# Altium project ZZCBoard4.0.PrjPCB
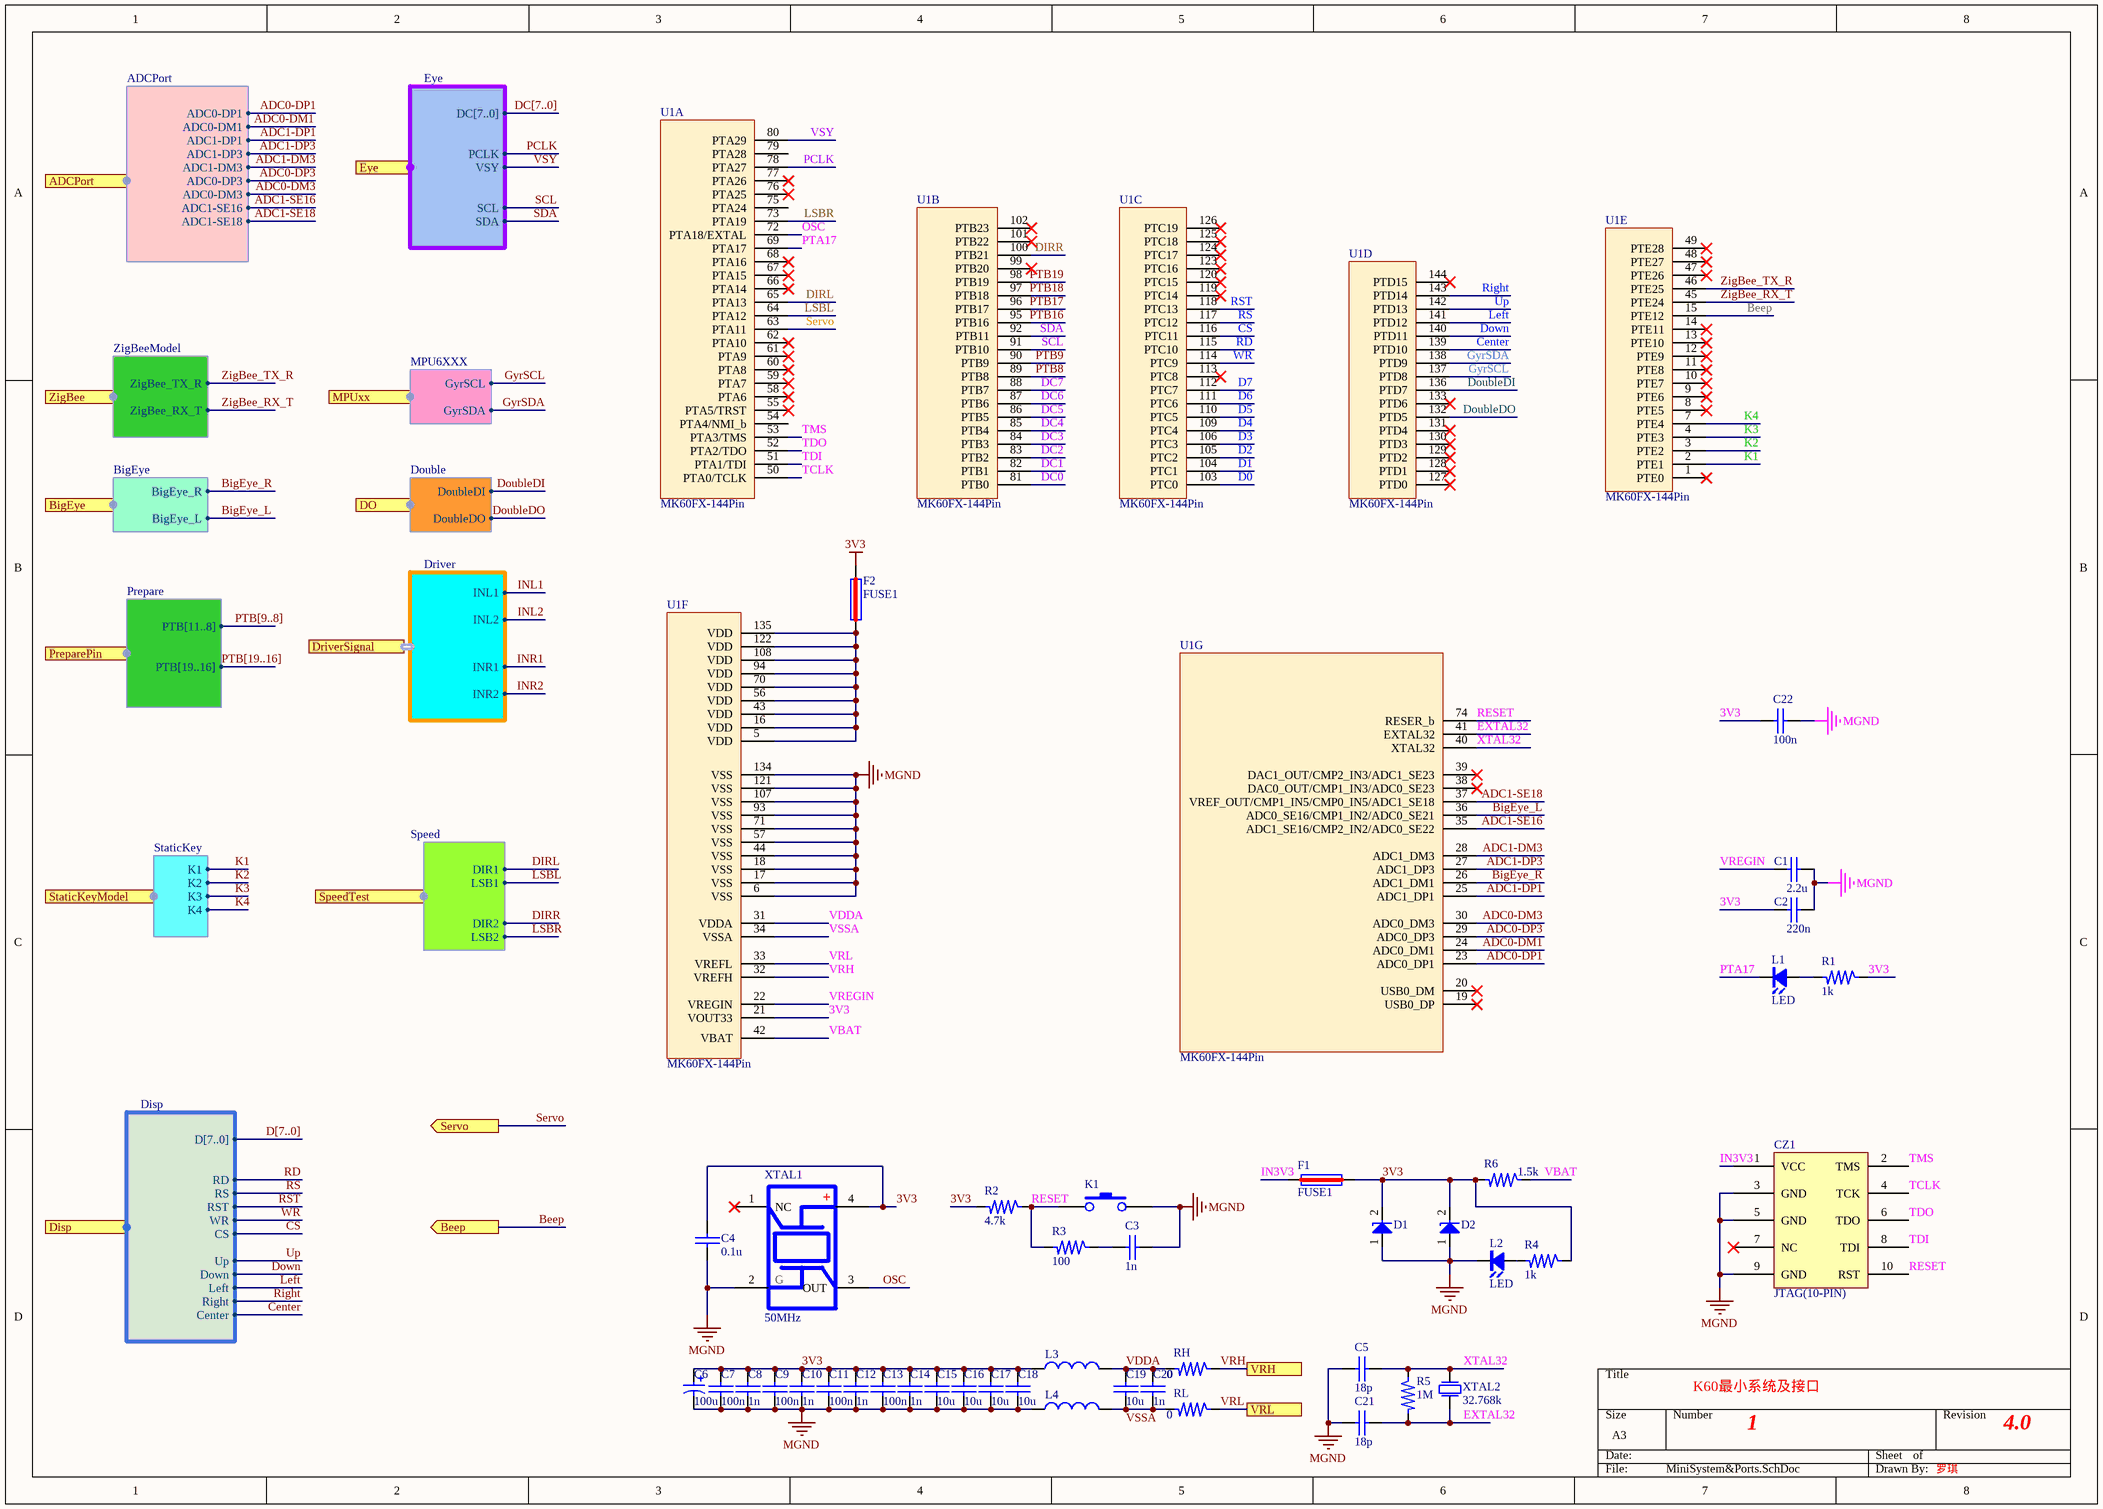
[diagram p0: MiniSystem&Ports.SchDoc]
7 sheets, 141 parts. Net scope: flat (ports and power ports of the same name join across sheets).
Board file: ZZCBoard4.0.PcbDoc
Sheets:
  MiniSystem&Ports.SchDoc
  ServoPower.SchDoc
  7971DoubleDriver.SchDoc
  Disp&Eye.SchDoc
  PowerGroup.SchDoc
  Models.SchDoc
  Measure&Select.SchDoc

## Sheet MiniSystem&Ports.SchDoc: K60最小系统及接口
size A3; DrawnBy: 罗琪; Engineer: 罗琪; Revision: 4.0; SheetNumber: 1

### Parts
C1  2.2u  [C0603]
C2  220n  [C0603]
C3  1n  [C0603]
C4  0.1u  [C0603]
C5  18p  [C0603]
C6  100u  [CAP-E SMD-C]
C7  100n  [C0603]
C8  1n  [C0603]
C9  100n  [C0603]
C10  1n  [C0603]
C11  100n  [C0603]
C12  1n  [C0603]
C13  100n  [C0603]
C14  1n  [C0603]
C15  10u  [C0805]
C16  10u  [C0805]
C17  10u  [C0805]
C18  10u  [C0805]
C19  10u  [C0805]
C20  1n  [C0603]
C21  18p  [C0603]
C22  100n  [C0603]
CZ1  JTAG(10-PIN)  [JTAG 10-pin Header]
D1  EN5819  [D1206]  (value not drawn)
D2  EN5819  [D1206]  (value not drawn)
F1  FUSE1  [FUSE-F1210]
F2  FUSE1  [FUSE-F1210]
K1  SW  [KEY-K2]  (value not drawn)
L1  LED  [LED0805TB]
L2  LED  [LED0805TB]
L3  INDUCTOR  [L0805]  (value not drawn)
L4  INDUCTOR  [L0805]  (value not drawn)
R1  1k  [R0603]
R2  4.7k  [R0603]
R3  100  [R0603]
R4  1k  [R0603]
R5  1M  [R0603]
R6  1.5k  [R0603]
RH  0  [R0603]
RL  0  [R0603]
U1  MK60FX-144Pin  [LQFP144]  (parts A,B,C,D,E,F,G of 7)
XTAL1  50MHz  [XTAL-6035]
XTAL2  32.768k  [XTAL_32.768]

### Ports
ADCPort (harness ADCPort), Beep (out), BigEye (harness BigEye), Disp (harness Disp), DO (harness Double), DriverSignal (harness Driver), Eye (harness Eye), MPUxx (harness MPU6XXX), PreparePin (harness Prepare), Servo (out), SpeedTest (harness Speed), StaticKeyModel (harness StaticKey), VRH, VRL, ZigBee (harness ZigBeeModel)

### Harnesses
MPU6XXX: GyrSCL, GyrSDA
ZigBeeModel: ZigBee_TX_R, ZigBee_RX_T
BigEye: BigEye_R, BigEye_L
Double: DoubleDI, DoubleDO
ADCPort: ADC0-DP1, ADC0-DM1, ADC1-DP1, ADC1-DP3, ADC1-DM3, ADC0-DP3, ADC0-DM3, ADC1-SE16, ADC1-SE18
Prepare: PTB[11..8], PTB[19..16]
Driver: INL1, INL2, INR1, INR2
Disp: D[7..0], RD, RS, RST, WR, Up, Down, Left, Right, Center, CS
Eye: DC[7..0], PCLK, VSY, SCL, SDA
StaticKey: K1, K2, K3, K4
Speed: DIR1, LSB1, LSB2, DIR2

### Nets
3V3: C2.2 C4.1 C6.1 C7.2 C8.2 C9.2 C10.2 C11.2 C12.2 C13.2 C14.2 C15.2 C16.2 C17.2 C18.2 C22.1 D1.2 D2.2 F1.2 F2.2 L3.1 R1.2 R2.1 R4.2 R6.1 U1.21(VOUT33) XTAL1.4(VCC)
MGND: C1.1 C2.1 C3.2 C4.2 C5.1 C6.2 C7.1 C8.1 C9.1 C10.1 C11.1 C12.1 C13.1 C14.1 C15.1 C16.1 C17.1 C18.1 C21.1 C22.2 CZ1.3(GND) CZ1.5(GND) CZ1.9(GND) D1.1 D2.1 K1.2 L2.2(K) L4.1 U1.6(VSS) U1.17(VSS) U1.18(VSS) U1.44(VSS) U1.57(VSS) U1.71(VSS) U1.93(VSS) U1.107(VSS) U1.121(VSS) U1.134(VSS) XTAL1.2(GND)
ADC0-DM1: U1.24(ADC0_DM1) ; port ADCPort.ADC0-DM1
ADC0-DM3: U1.30(ADC0_DM3) ; port ADCPort.ADC0-DM3
ADC0-DP1: U1.23(ADC0_DP1) ; port ADCPort.ADC0-DP1
ADC0-DP3: U1.29(ADC0_DP3) ; port ADCPort.ADC0-DP3
ADC1-DM3: U1.28(ADC1_DM3) ; port ADCPort.ADC1-DM3
ADC1-DP1: U1.25(ADC1_DP1) ; port ADCPort.ADC1-DP1
ADC1-DP3: U1.27(ADC1_DP3) ; port ADCPort.ADC1-DP3
ADC1-SE16: U1.35(ADC1_SE16/CMP2_IN2/ADC0_SE22) ; port ADCPort.ADC1-SE16
ADC1-SE18: U1.37(VREF_OUT/CMP1_IN5/CMP0_IN5/ADC1_SE18) ; port ADCPort.ADC1-SE18
Beep: U1.15(PTE12) ; port Beep
BigEye_L: U1.36(ADC0_SE16/CMP1_IN2/ADC0_SE21) ; port BigEye.BigEye_L
BigEye_R: U1.26(ADC1_DM1) ; port BigEye.BigEye_R
Center: U1.139(PTD10) ; port Disp.Center
CS: U1.116(PTC11) ; port Disp.CS
D0: U1.103(PTC0)
D1: U1.104(PTC1)
D2: U1.105(PTC2)
D3: U1.106(PTC3)
D4: U1.109(PTC4)
D5: U1.110(PTC5)
D6: U1.111(PTC6)
D7: U1.112(PTC7)
DC0: U1.81(PTB0)
DC1: U1.82(PTB1)
DC2: U1.83(PTB2)
DC3: U1.84(PTB3)
DC4: U1.85(PTB4)
DC5: U1.86(PTB5)
DC6: U1.87(PTB6)
DC7: U1.88(PTB7)
DIRL: U1.65(PTA13) ; port SpeedTest.DIR1
DIRR: U1.100(PTB21) ; port SpeedTest.DIR2
DoubleDI: U1.136(PTD7) ; port DO.DoubleDI
DoubleDO: U1.132(PTD5) ; port DO.DoubleDO
Down: U1.140(PTD11) ; port Disp.Down
EXTAL32: C21.2 R5.1 U1.41(EXTAL32) XTAL2.2(P2)
GyrSCL: U1.137(PTD8) ; port MPUxx.GyrSCL
GyrSDA: U1.138(PTD9) ; port MPUxx.GyrSDA
IN3V3: CZ1.1(VCC) F1.1
K1: U1.2(PTE1) ; port StaticKeyModel.K1
K2: U1.3(PTE2) ; port StaticKeyModel.K2
K3: U1.4(PTE3) ; port StaticKeyModel.K3
K4: U1.7(PTE4) ; port StaticKeyModel.K4
Left: U1.141(PTD12) ; port Disp.Left
LSBL: U1.64(PTA12) ; port SpeedTest.LSB1
LSBR: U1.73(PTA19) ; port SpeedTest.LSB2
OSC: U1.72(PTA18/EXTAL) XTAL1.3(OUT)
PCLK: U1.78(PTA27) ; port Eye.PCLK
PTA17: L1.2(K) U1.69(PTA17)
PTB8: U1.89(PTB8)
PTB9: U1.90(PTB9)
PTB16: U1.95(PTB16)
PTB17: U1.96(PTB17)
PTB18: U1.97(PTB18)
PTB19: U1.98(PTB19)
RD: U1.115(PTC10) ; port Disp.RD
RESET: CZ1.10(RST) K1.1 R2.2 R3.1 U1.74(RESER_b)
Right: U1.143(PTD14) ; port Disp.Right
RS: U1.117(PTC12) ; port Disp.RS
RST: U1.118(PTC13) ; port Disp.RST
SCL: U1.91(PTB10) ; port Eye.SCL
SDA: U1.92(PTB11) ; port Eye.SDA
Servo: U1.63(PTA11) ; port Servo
TCLK: CZ1.4(TCK) U1.50(PTA0/TCLK)
TDI: CZ1.8(TDI) U1.51(PTA1/TDI)
TDO: CZ1.6(TDO) U1.52(PTA2/TDO)
TMS: CZ1.2(TMS) U1.53(PTA3/TMS)
Up: U1.142(PTD13) ; port Disp.Up
VBAT: R6.2 U1.42(VBAT)
VDDA: C19.2 C20.2 L3.2 RH.1 U1.31(VDDA)
VREGIN: C1.2 U1.22(VREGIN)
VRH: RH.2 U1.32(VREFH) ; port VRH
VRL: RL.2 U1.33(VREFL) ; port VRL
VSSA: C19.1 C20.1 L4.2 RL.1 U1.34(VSSA)
VSY: U1.80(PTA29) ; port Eye.VSY
WR: U1.114(PTC9) ; port Disp.WR
XTAL32: C5.2 R5.2 U1.40(XTAL32) XTAL2.1(P1)
ZigBee_RX_T: U1.45(PTE24) ; port ZigBee.ZigBee_RX_T
ZigBee_TX_R: U1.46(PTE25) ; port ZigBee.ZigBee_TX_R
NetC3_1: C3.1 R3.2
NetF2_1: F2.1 U1.5(VDD) U1.16(VDD) U1.43(VDD) U1.56(VDD) U1.70(VDD) U1.94(VDD) U1.108(VDD) U1.122(VDD) U1.135(VDD)
NetL1_1: L1.1(A) R1.1
NetL2_1: L2.1(A) R4.1

Not connected (* = marked no-connect by the designer): CZ1 7(NC)*; U1 1(PTE0)* 8(PTE5)* 9(PTE6)* 10(PTE7)* 11(PTE8)* 12(PTE9)* 13(PTE10)* 14(PTE11)* 19(USB0_DP)* 20(USB0_DM)* 38(DAC0_OUT/CMP1_IN3/ADC0_SE23)* 39(DAC1_OUT/CMP2_IN3/ADC1_SE23)* 47(PTE26)* 48(PTE27)* 49(PTE28)* 54(PTA4/NMI_b) 55(PTA5/TRST)* 58(PTA6)* 59(PTA7)* 60(PTA8)* 61(PTA9)* 62(PTA10)* 66(PTA14)* 67(PTA15)* 68(PTA16)* 75(PTA24) 76(PTA25)* 77(PTA26)* 79(PTA28) 99(PTB20)* 101(PTB22)* 102(PTB23)* 113(PTC8)* 119(PTC14)* 120(PTC15)* 123(PTC16)* 124(PTC17)* 125(PTC18)* 126(PTC19)* 127(PTD0)* 128(PTD1)* 129(PTD2)* 130(PTD3)* 131(PTD4)* 133(PTD6)* 144(PTD15)*; XTAL1 1(NC)*

### Buses and harness runs
bus D[7..0]
bus DC[7..0]
bus PTB[9..8]
bus PTB[19..16]

### Notes on the sheet
- (in symbol XTAL-Active) +; G

### Library data of the parts
C1-C5 C7-C22 = Capacitor: 电容
C6 = Capacitor-Polarity: 极性电容
D1 D2 = DIODE稳压
F1 F2 = FUSE1: FUSE
K1 = KEY: 按键
R1-R6 RH RL = Resistor: 电阻
U1 = MK60FX144
XTAL1 = XTAL-Active
XTAL2 = XTAL: CRYSTAL

## Sheet ServoPower.SchDoc
size A4
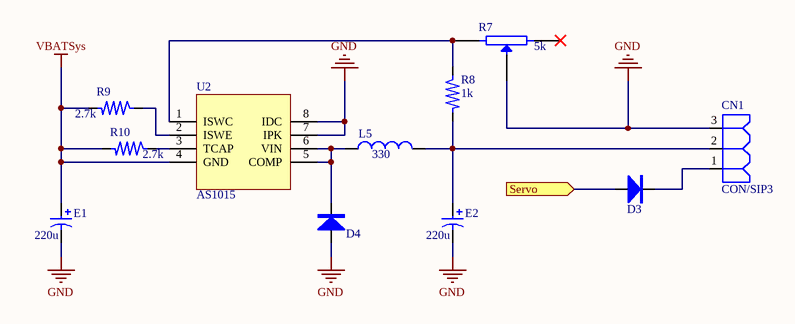
[diagram p1: ServoPower.SchDoc]

### Parts
CN1  CON/SIP3  [HDR1X3]
D3  DIODE  [DO-214]  (value not drawn)
D4  DIODE  [DO-214]  (value not drawn)
E1  220u  [CAP-E SMD-D]
E2  220u  [CAP-E SMD-D]
L5  330  [L7X7]
R7  5k  [RES ADJ-3296W]
R8  1k  [R0603]
R9  2.7k  [R0603]
R10  2.7k  [R0603]
U2  AS1015  [SOIC8]

### Ports
Servo (in)

### Nets
GND: CN1.3 D4.1(A) E1.2 E2.2 R7.3(W) U2.7(IPK) U2.8(IDC)
VBATSys: E1.1 R9.1 R10.1 U2.4(GND)
Servo: D3.1(A) ; port Servo
NetCN1_1: CN1.1 D3.2(K)
NetCN1_2: CN1.2 E2.1 L5.2 R8.1
NetD4_2: D4.2(K) L5.1 U2.5(COMP) U2.6(VIN)
NetR7_2: R7.2 R8.2 U2.1(ISWC)
NetR9_2: R9.2 U2.2(ISWE)
NetR10_2: R10.2 U2.3(TCAP)

Not connected (* = marked no-connect by the designer): R7 1*

### Library data of the parts
D3 D4 = DIODE: 二极管
E1 E2 = Capacitor-Polarity: 极性电容
L5 = INDUCTOR
R7 = Resistor-Potentiometer: 滑动变阻器
R8-R10 = Resistor: 电阻
U2 = MC34603: 充电电路芯片

## Sheet 7971DoubleDriver.SchDoc
size A3
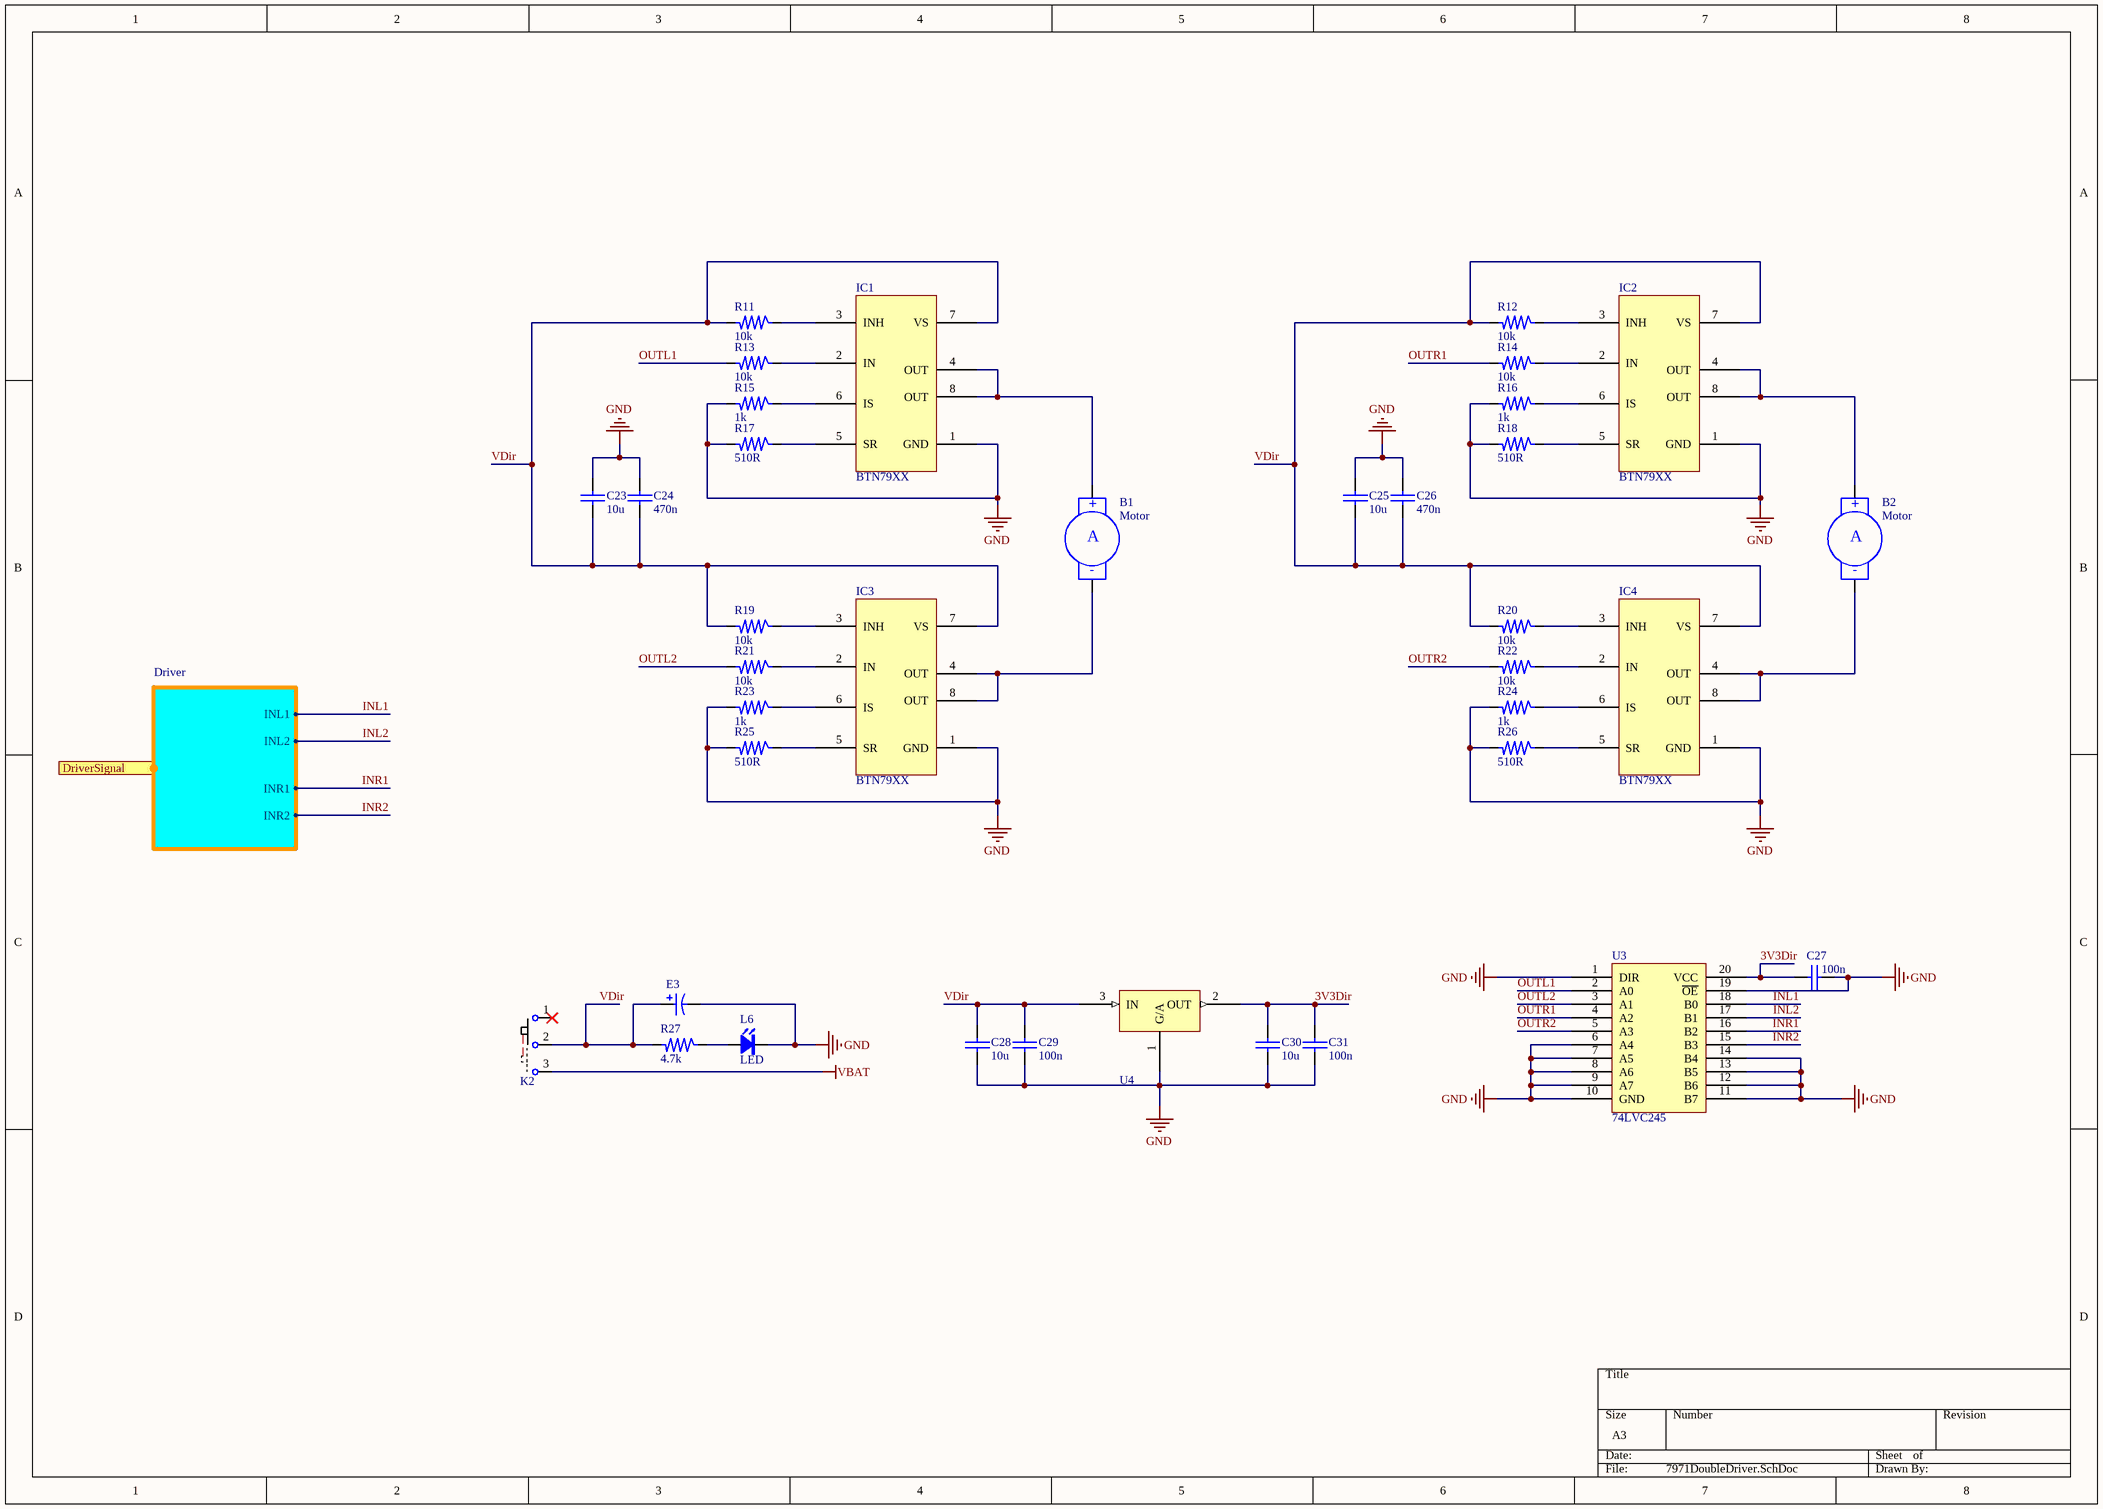
[diagram p2: 7971DoubleDriver.SchDoc]

### Parts
B1  Motor  [KF301-2P]
B2  Motor  [KF301-2P]
C23  10u  [C0805]
C24  470n  [C0603]
C25  10u  [C0805]
C26  470n  [C0603]
C27  100n  [C0603]
C28  10u  [C0805]
C29  100n  [C0603]
C30  10u  [C0805]
C31  100n  [C0603]
E3  100u  [CAP-E SMD-D]  (value not drawn)
IC1  BTN79XX  [PG-TO263-7-1]
IC2  BTN79XX  [PG-TO263-7-1]
IC3  BTN79XX  [PG-TO263-7-1]
IC4  BTN79XX  [PG-TO263-7-1]
K2  RES-SEL  [NIUZI_SWITCH]  (value not drawn)
L6  LED  [LED0805TB]
R11  10k  [R0603]
R12  10k  [R0603]
R13  10k  [R0603]
R14  10k  [R0603]
R15  1k  [R0603]
R16  1k  [R0603]
R17  510R  [R0603]
R18  510R  [R0603]
R19  10k  [R0603]
R20  10k  [R0603]
R21  10k  [R0603]
R22  10k  [R0603]
R23  1k  [R0603]
R24  1k  [R0603]
R25  510R  [R0603]
R26  510R  [R0603]
R27  4.7k  [R0603]
U3  74LVC245  [TSSOP20]
U4  AMS1117-XX  [SOT223]  (value not drawn)

### Ports
DriverSignal (harness Driver)

### Harnesses
Driver: INL1, INL2, INR1, INR2

### Nets
GND: C23.1 C24.2 C25.1 C26.2 C27.2 C28.2 C29.2 C30.2 C31.2 E3.2 IC1.1(GND) IC2.1(GND) IC3.1(GND) IC4.1(GND) L6.2(K) R15.1 R16.1 R17.1 R18.1 R23.1 R24.1 R25.1 R26.1 U3.1(DIR) U3.6(A4) U3.7(A5) U3.8(A6) U3.9(A7) U3.10(GND) U3.11(B7) U3.12(B6) U3.13(B5) U3.14(B4) U3.19(~{OE}) U4.1(G/A)
VBAT: K2.3
3V3Dir: C27.1 C30.1 C31.1 U3.20(VCC) U4.2(OUT)
INL1: U3.18(B0) ; port DriverSignal.INL1
INL2: U3.17(B1) ; port DriverSignal.INL2
INR1: U3.16(B2) ; port DriverSignal.INR1
INR2: U3.15(B3) ; port DriverSignal.INR2
OUTL1: R13.1 U3.2(A0)
OUTL2: R21.1 U3.3(A1)
OUTR1: R14.1 U3.4(A2)
OUTR2: R22.1 U3.5(A3)
VDir: C23.2 C24.1 C25.2 C26.1 C28.1 C29.1 E3.1 IC1.7(VS) IC2.7(VS) IC3.7(VS) IC4.7(VS) K2.2 R11.1 R12.1 R19.1 R20.1 R27.1 U4.3(IN)
NetB1_1: B1.1(+) IC1.4(OUT) IC1.8(OUT)
NetB1_2: B1.2(-) IC3.4(OUT) IC3.8(OUT)
NetB2_1: B2.1(+) IC2.4(OUT) IC2.8(OUT)
NetB2_2: B2.2(-) IC4.4(OUT) IC4.8(OUT)
NetIC1_2: IC1.2(IN) R13.2
NetIC1_3: IC1.3(INH) R11.2
NetIC1_5: IC1.5(SR) R17.2
NetIC1_6: IC1.6(IS) R15.2
NetIC2_2: IC2.2(IN) R14.2
NetIC2_3: IC2.3(INH) R12.2
NetIC2_5: IC2.5(SR) R18.2
NetIC2_6: IC2.6(IS) R16.2
NetIC3_2: IC3.2(IN) R21.2
NetIC3_3: IC3.3(INH) R19.2
NetIC3_5: IC3.5(SR) R25.2
NetIC3_6: IC3.6(IS) R23.2
NetIC4_2: IC4.2(IN) R22.2
NetIC4_3: IC4.3(INH) R20.2
NetIC4_5: IC4.5(SR) R26.2
NetIC4_6: IC4.6(IS) R24.2
NetL6_1: L6.1(A) R27.2

Not connected (* = marked no-connect by the designer): K2 1*

### Notes on the sheet
- (in symbol Motor Servo) A

### Library data of the parts
B1 B2 = Motor Servo: Servo Motor
C23-C31 = Capacitor: 电容
E3 = Capacitor-Polarity: 极性电容
IC1-IC4 = BTN79XX: BTN7960/7971/799X
K2 = RES-SEL: 扭子开关
R11-R27 = Resistor: 电阻
U3 = 74lvc245: 8位5伏转3.3伏电平转换芯片
U4 = AMS1117-XX: 稳压芯片

## Sheet Disp&Eye.SchDoc
size A4
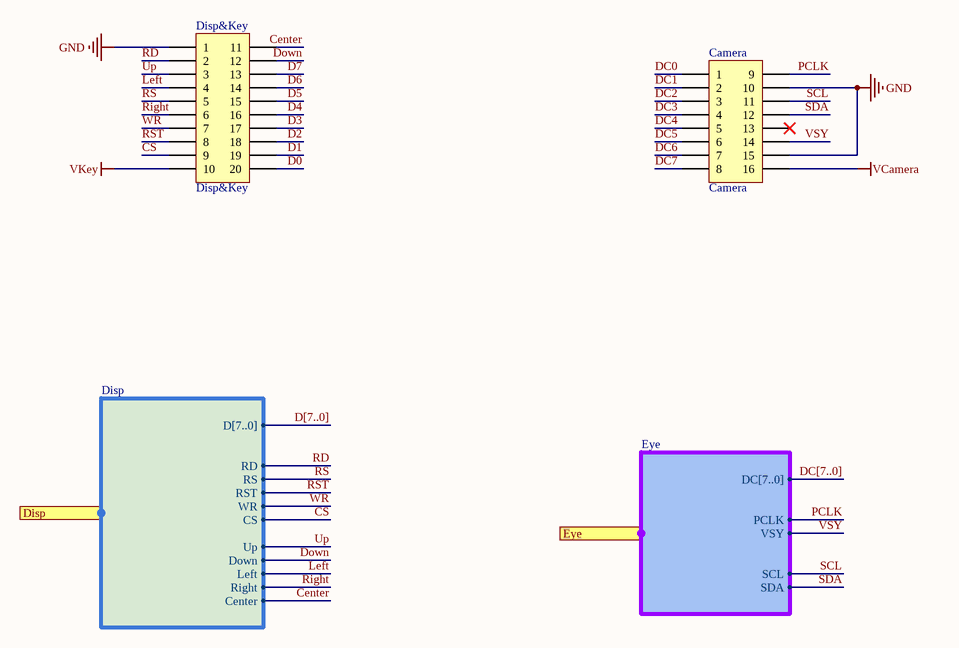
[diagram p3: Disp&Eye.SchDoc]

### Parts
Camera  Camera  [HDR2X8_CEN]
Disp&Key  Disp&Key  [HDR2X10_CEN]

### Ports
Disp (harness Disp), Eye (harness Eye)

### Harnesses
Disp: D[7..0], RD, RS, RST, WR, Up, Down, Left, Right, Center, CS
Eye: DC[7..0], PCLK, VSY, SCL, SDA

### Nets
GND: Camera.10 Camera.15 Disp&Key.1
VCamera: Camera.16
VKey: Disp&Key.10
Center: Disp&Key.11 ; port Disp.Center
CS: Disp&Key.9 ; port Disp.CS
D0: Disp&Key.20
D1: Disp&Key.19
D2: Disp&Key.18
D3: Disp&Key.17
D4: Disp&Key.16
D5: Disp&Key.15
D6: Disp&Key.14
D7: Disp&Key.13
DC0: Camera.1
DC1: Camera.2
DC2: Camera.3
DC3: Camera.4
DC4: Camera.5
DC5: Camera.6
DC6: Camera.7
DC7: Camera.8
Down: Disp&Key.12 ; port Disp.Down
Left: Disp&Key.4 ; port Disp.Left
PCLK: Camera.9 ; port Eye.PCLK
RD: Disp&Key.2 ; port Disp.RD
Right: Disp&Key.6 ; port Disp.Right
RS: Disp&Key.5 ; port Disp.RS
RST: Disp&Key.8 ; port Disp.RST
SCL: Camera.11 ; port Eye.SCL
SDA: Camera.12 ; port Eye.SDA
Up: Disp&Key.3 ; port Disp.Up
VSY: Camera.14 ; port Eye.VSY
WR: Disp&Key.7 ; port Disp.WR

Not connected (* = marked no-connect by the designer): Camera 13*

### Buses and harness runs
bus D[7..0]
bus DC[7..0]

### Library data of the parts
Camera = Header 8X2A: Header, 8-Pin, Dual row; LatestRevisionDate: 17-Jul-2002; LatestRevisionNote: Re-released for DXP Platform.; Publisher: Altium Limited
Disp&Key = Header 10X2A: Header, 10-Pin, Dual row; LatestRevisionDate: 17-Jul-2002; LatestRevisionNote: Re-released for DXP Platform.; Publisher: Altium Limited

## Sheet PowerGroup.SchDoc
size A4
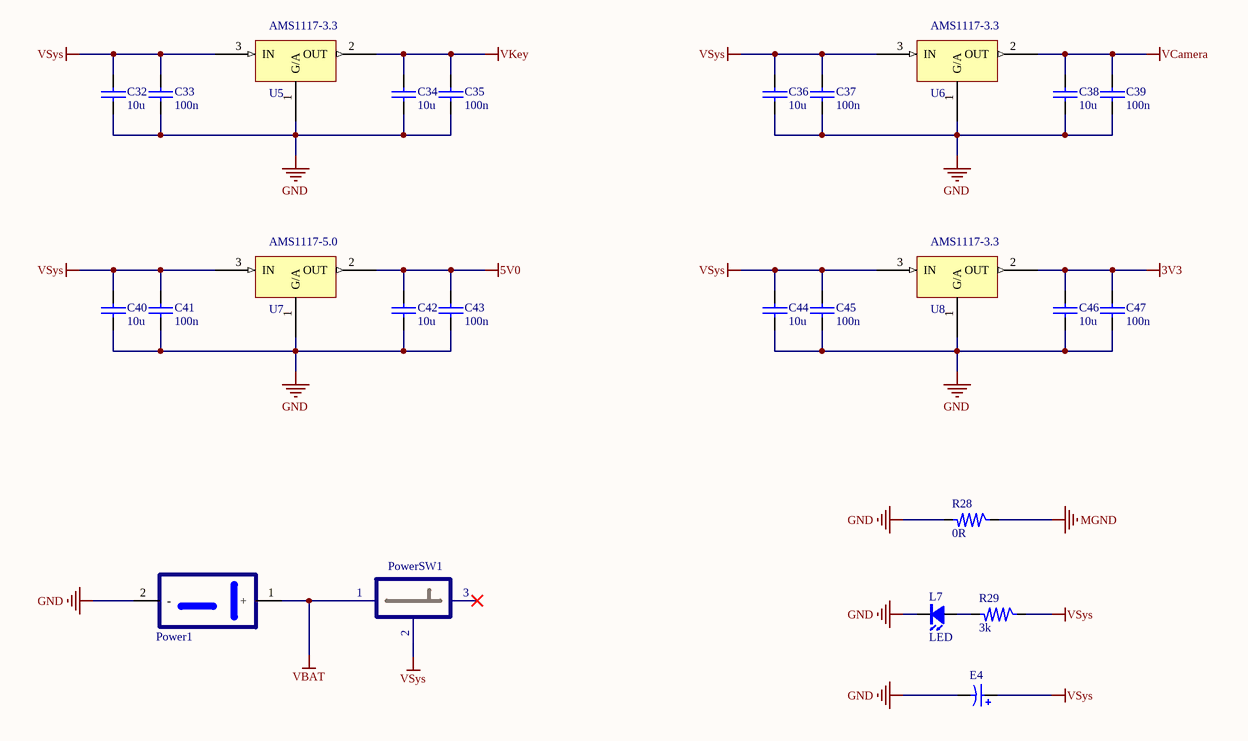
[diagram p4: PowerGroup.SchDoc]

### Parts
C32  10u  [C0805]
C33  100n  [C0603]
C34  10u  [C0805]
C35  100n  [C0603]
C36  10u  [C0805]
C37  100n  [C0603]
C38  10u  [C0805]
C39  100n  [C0603]
C40  10u  [C0805]
C41  100n  [C0603]
C42  10u  [C0805]
C43  100n  [C0603]
C44  10u  [C0805]
C45  100n  [C0603]
C46  10u  [C0805]
C47  100n  [C0603]
E4  Capacitor-Polarity  [CAP-E SMD-D]  (value not drawn)
L7  LED  [LED0805TB]
Power1  XT60  [T型头]  (value not drawn)
PowerSW1  Power  [NIUZI_SWITCH]  (value not drawn)
R28  0R  [R0603]
R29  3k  [R0603]
U5  AMS1117-3.3  [SOT223]
U6  AMS1117-3.3  [SOT223]
U7  AMS1117-5.0  [SOT223]
U8  AMS1117-3.3  [SOT223]

### Nets
3V3: C46.1 C47.1 U8.2(OUT)
5V0: C42.1 C43.1 U7.2(OUT)
GND: C32.2 C33.2 C34.2 C35.2 C36.2 C37.2 C38.2 C39.2 C40.2 C41.2 C42.2 C43.2 C44.2 C45.2 C46.2 C47.2 E4.2 L7.2(K) Power1.2(-) R28.1 U5.1(G/A) U6.1(G/A) U7.1(G/A) U8.1(G/A)
MGND: R28.2
VBAT: Power1.1(+) PowerSW1.1
VCamera: C38.1 C39.1 U6.2(OUT)
VKey: C34.1 C35.1 U5.2(OUT)
VSys: C32.1 C33.1 C36.1 C37.1 C40.1 C41.1 C44.1 C45.1 E4.1 PowerSW1.2 R29.2 U5.3(IN) U6.3(IN) U7.3(IN) U8.3(IN)
NetL7_1: L7.1(A) R29.1

Not connected (* = marked no-connect by the designer): PowerSW1 3*

### Notes on the sheet
- (in symbol AMS1117-) VO; VI

### Library data of the parts
C32-C47 = Capacitor: 电容
E4 = Capacitor-Polarity: 极性电容
PowerSW1 = PowerSW
R28 R29 = Resistor: 电阻
U5-U8 = AMS1117-XX: 稳压芯片

## Sheet Models.SchDoc
size A4
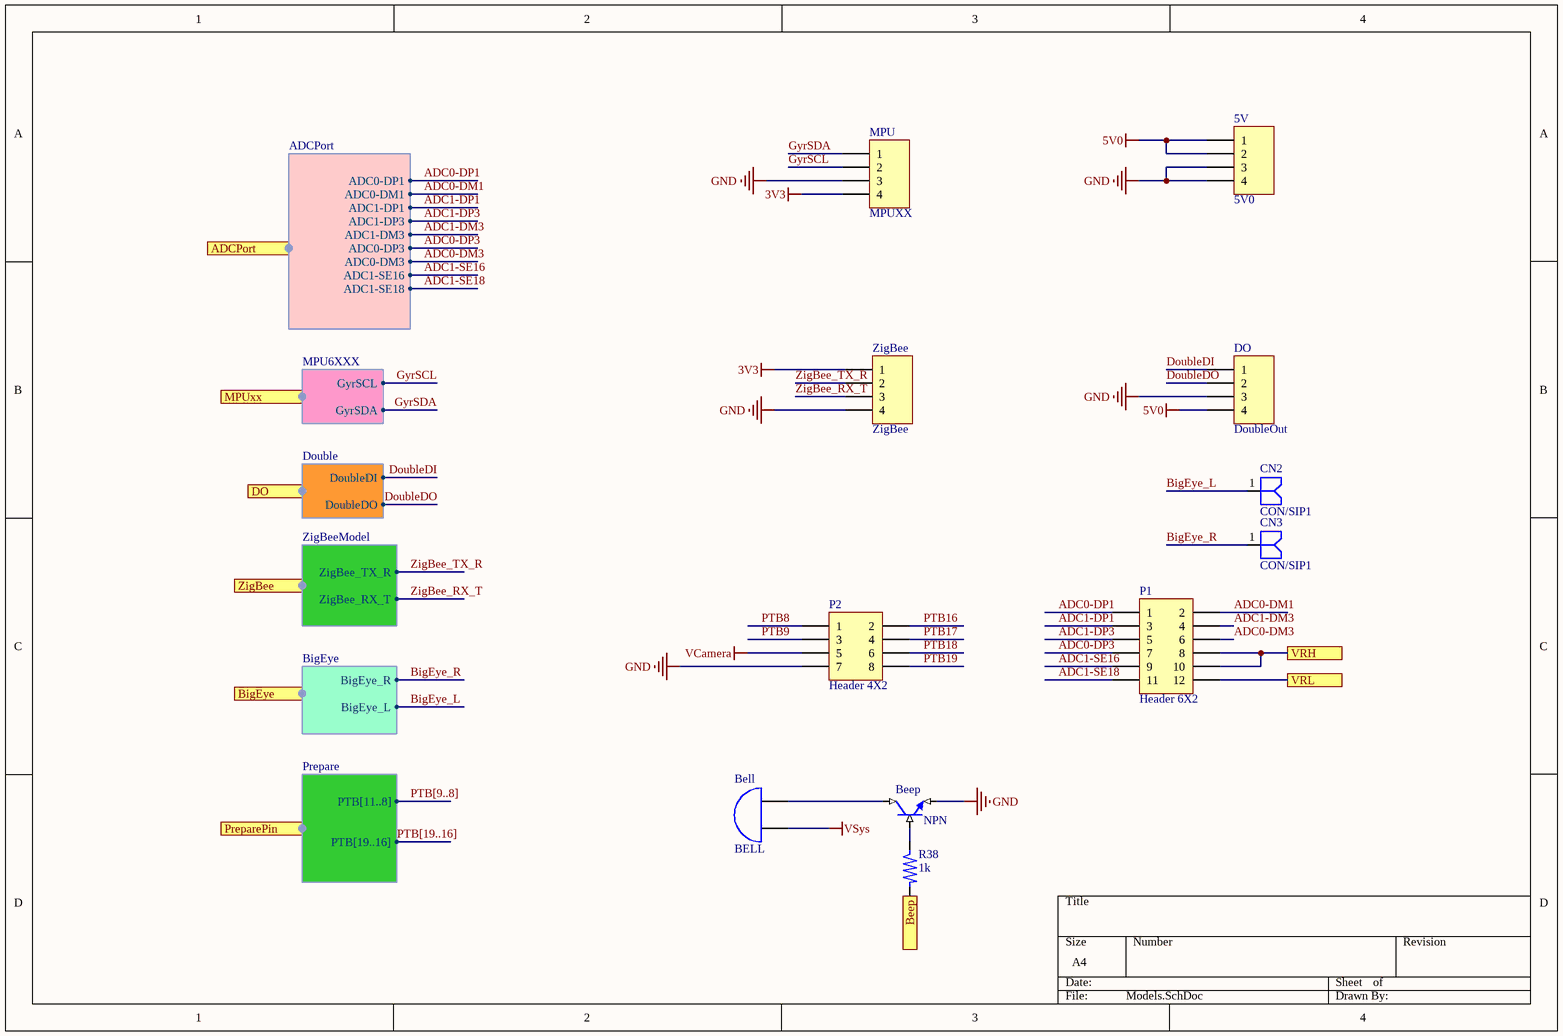
[diagram p5: Models.SchDoc]

### Parts
5V  5V0  [HDR1X4]
Beep  NPN  [SOT23-3]
Bell  BELL  [BEEP]
CN2  CON/SIP1  [HDR1X1]
CN3  CON/SIP1  [HDR1X1]
DO  DoubleOut  [HDR1X4]
MPU  MPUXX  [HDR1X4]
P1  Header 6X2  [HDR2X6]
P2  Header 4X2  [HDR2X4]
R38  1k  [R0603]
ZigBee  ZigBee  [HDR1X4]

### Ports
ADCPort (harness ADCPort), Beep (in), BigEye (harness BigEye), DO (harness Double), MPUxx (harness MPU6XXX), PreparePin (harness Prepare), VRH, VRL, ZigBee (harness ZigBeeModel)

### Harnesses
MPU6XXX: GyrSCL, GyrSDA
ZigBeeModel: ZigBee_TX_R, ZigBee_RX_T
BigEye: BigEye_R, BigEye_L
Double: DoubleDI, DoubleDO
ADCPort: ADC0-DP1, ADC0-DM1, ADC1-DP1, ADC1-DP3, ADC1-DM3, ADC0-DP3, ADC0-DM3, ADC1-SE16, ADC1-SE18
Prepare: PTB[11..8], PTB[19..16]

### Nets
3V3: MPU.4 ZigBee.1
5V0: 5V.1 5V.2 DO.4
GND: 5V.3 5V.4 Beep.2(E) DO.3 MPU.3 P2.7 ZigBee.4
VCamera: P2.5
VSys: Bell.1(A)
ADC0-DM1: P1.2 ; port ADCPort.ADC0-DM1
ADC0-DM3: P1.6 ; port ADCPort.ADC0-DM3
ADC0-DP1: P1.1 ; port ADCPort.ADC0-DP1
ADC0-DP3: P1.7 ; port ADCPort.ADC0-DP3
ADC1-DM3: P1.4 ; port ADCPort.ADC1-DM3
ADC1-DP1: P1.3 ; port ADCPort.ADC1-DP1
ADC1-DP3: P1.5 ; port ADCPort.ADC1-DP3
ADC1-SE16: P1.9 ; port ADCPort.ADC1-SE16
ADC1-SE18: P1.11 ; port ADCPort.ADC1-SE18
Beep: R38.1 ; port Beep
BigEye_L: CN2.1 ; port BigEye.BigEye_L
BigEye_R: CN3.1 ; port BigEye.BigEye_R
DoubleDI: DO.1 ; port DO.DoubleDI
DoubleDO: DO.2 ; port DO.DoubleDO
GyrSCL: MPU.2 ; port MPUxx.GyrSCL
GyrSDA: MPU.1 ; port MPUxx.GyrSDA
PTB8: P2.1
PTB9: P2.3
PTB16: P2.2
PTB17: P2.4
PTB18: P2.6
PTB19: P2.8
VRH: P1.8 P1.10 ; port VRH
VRL: P1.12 ; port VRL
ZigBee_RX_T: ZigBee.3 ; port ZigBee.ZigBee_RX_T
ZigBee_TX_R: ZigBee.2 ; port ZigBee.ZigBee_TX_R
NetBeep_1: Beep.1(B) R38.2
NetBeep_3: Beep.3(C) Bell.2(B)

### Buses and harness runs
bus PTB[9..8]
bus PTB[19..16]

### Library data of the parts
5V DO MPU ZigBee = Header 4: Header, 4-Pin; LatestRevisionDate: 17-Jul-2002; LatestRevisionNote: Re-released for DXP Platform.; Publisher: Altium Limited
Beep = NPN: triode
Bell = BELL: 蜂鸣器
P1 = Header 6X2: Header, 6-Pin, Dual row; LatestRevisionDate: 17-Jul-2002; LatestRevisionNote: Re-released for DXP Platform.; Publisher: Altium Limited
P2 = Header 4X2: Header, 4-Pin, Dual row; LatestRevisionDate: 17-Jul-2002; LatestRevisionNote: Re-released for DXP Platform.; Publisher: Altium Limited
R38 = Resistor: 电阻

## Sheet Measure&Select.SchDoc
size A4
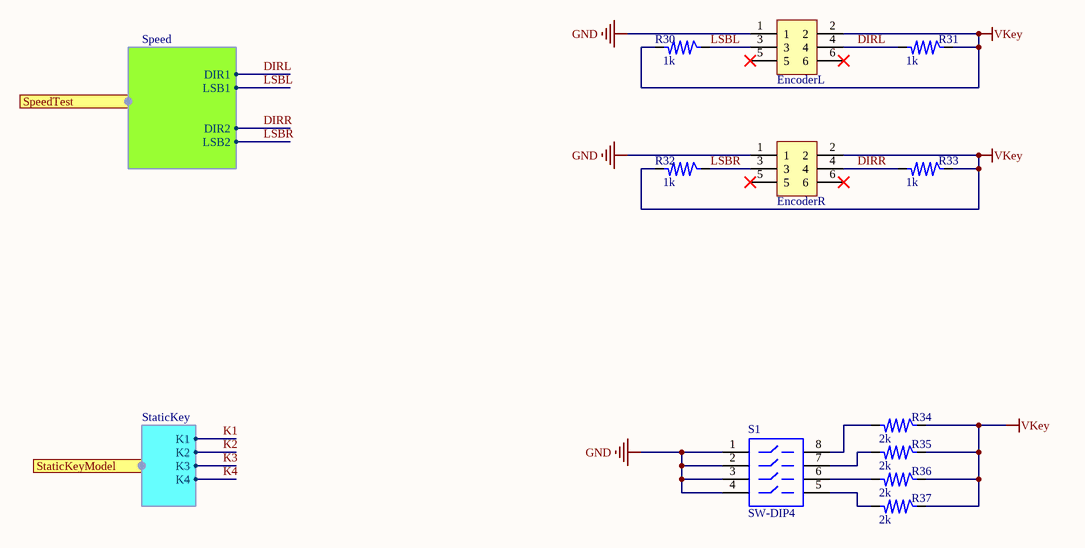
[diagram p6: Measure&Select.SchDoc]

### Parts
EncoderL  编码器  [编码器]  (value not drawn)
EncoderR  编码器  [编码器]  (value not drawn)
R30  1k  [R0603]
R31  1k  [R0603]
R32  1k  [R0603]
R33  1k  [R0603]
R34  2k  [R0603]
R35  2k  [R0603]
R36  2k  [R0603]
R37  2k  [R0603]
S1  SW-DIP4  [SW-DIP4]

### Ports
SpeedTest (harness Speed), StaticKeyModel (harness StaticKey)

### Harnesses
Speed: DIR1, LSB1, LSB2, DIR2
StaticKey: K1, K2, K3, K4

### Nets
GND: EncoderL.1 EncoderR.1 S1.1 S1.2 S1.3 S1.4
VKey: EncoderL.2 EncoderR.2 R30.1 R31.2 R32.1 R33.2 R34.2 R35.2 R36.2 R37.2
DIRL: EncoderL.4 R31.1 ; port SpeedTest.DIR1
DIRR: EncoderR.4 R33.1 ; port SpeedTest.DIR2
LSBL: EncoderL.3 R30.2 ; port SpeedTest.LSB1
LSBR: EncoderR.3 R32.2 ; port SpeedTest.LSB2
NetR34_1: R34.1 S1.8
NetR35_1: R35.1 S1.7
NetR36_1: R36.1 S1.6
NetR37_1: R37.1 S1.5

Not connected (* = marked no-connect by the designer): EncoderL 5* 6*; EncoderR 5* 6*

### Library data of the parts
R30-R37 = Resistor: 电阻

## Nets that join several sheets
3V3: MiniSystem&Ports (27 pins), PowerGroup (C46.1 C47.1 U8.2), Models (MPU.4 ZigBee.1)
5V0: PowerGroup (C42.1 C43.1 U7.2), Models (5V.1 5V.2 DO.4)
GND: ServoPower (7 pins), 7971DoubleDriver (35 pins), Disp&Eye (Camera.10 Camera.15 Disp&Key.1), PowerGroup (24 pins), Models (7 pins), Measure&Select (6 pins)
MGND: MiniSystem&Ports (39 pins), PowerGroup (R28.2)
VBAT: 7971DoubleDriver (K2.3), PowerGroup (Power1.1 PowerSW1.1)
VCamera: Disp&Eye (Camera.16), PowerGroup (C38.1 C39.1 U6.2), Models (P2.5)
VKey: Disp&Eye (Disp&Key.10), PowerGroup (C34.1 C35.1 U5.2), Measure&Select (10 pins)
VSys: PowerGroup (15 pins), Models (Bell.1)
ADC0-DM1: MiniSystem&Ports (U1.24), Models (P1.2)
ADC0-DM3: MiniSystem&Ports (U1.30), Models (P1.6)
ADC0-DP1: MiniSystem&Ports (U1.23), Models (P1.1)
ADC0-DP3: MiniSystem&Ports (U1.29), Models (P1.7)
ADC1-DM3: MiniSystem&Ports (U1.28), Models (P1.4)
ADC1-DP1: MiniSystem&Ports (U1.25), Models (P1.3)
ADC1-DP3: MiniSystem&Ports (U1.27), Models (P1.5)
ADC1-SE16: MiniSystem&Ports (U1.35), Models (P1.9)
ADC1-SE18: MiniSystem&Ports (U1.37), Models (P1.11)
Beep: MiniSystem&Ports (U1.15), Models (R38.1)
BigEye_L: MiniSystem&Ports (U1.36), Models (CN2.1)
BigEye_R: MiniSystem&Ports (U1.26), Models (CN3.1)
Center: MiniSystem&Ports (U1.139), Disp&Eye (Disp&Key.11)
CS: MiniSystem&Ports (U1.116), Disp&Eye (Disp&Key.9)
D0: MiniSystem&Ports (U1.103), Disp&Eye (Disp&Key.20)
D1: MiniSystem&Ports (U1.104), Disp&Eye (Disp&Key.19)
D2: MiniSystem&Ports (U1.105), Disp&Eye (Disp&Key.18)
D3: MiniSystem&Ports (U1.106), Disp&Eye (Disp&Key.17)
D4: MiniSystem&Ports (U1.109), Disp&Eye (Disp&Key.16)
D5: MiniSystem&Ports (U1.110), Disp&Eye (Disp&Key.15)
D6: MiniSystem&Ports (U1.111), Disp&Eye (Disp&Key.14)
D7: MiniSystem&Ports (U1.112), Disp&Eye (Disp&Key.13)
DC0: MiniSystem&Ports (U1.81), Disp&Eye (Camera.1)
DC1: MiniSystem&Ports (U1.82), Disp&Eye (Camera.2)
DC2: MiniSystem&Ports (U1.83), Disp&Eye (Camera.3)
DC3: MiniSystem&Ports (U1.84), Disp&Eye (Camera.4)
DC4: MiniSystem&Ports (U1.85), Disp&Eye (Camera.5)
DC5: MiniSystem&Ports (U1.86), Disp&Eye (Camera.6)
DC6: MiniSystem&Ports (U1.87), Disp&Eye (Camera.7)
DC7: MiniSystem&Ports (U1.88), Disp&Eye (Camera.8)
DIRL: MiniSystem&Ports (U1.65), Measure&Select (EncoderL.4 R31.1)
DIRR: MiniSystem&Ports (U1.100), Measure&Select (EncoderR.4 R33.1)
DoubleDI: MiniSystem&Ports (U1.136), Models (DO.1)
DoubleDO: MiniSystem&Ports (U1.132), Models (DO.2)
Down: MiniSystem&Ports (U1.140), Disp&Eye (Disp&Key.12)
GyrSCL: MiniSystem&Ports (U1.137), Models (MPU.2)
GyrSDA: MiniSystem&Ports (U1.138), Models (MPU.1)
Left: MiniSystem&Ports (U1.141), Disp&Eye (Disp&Key.4)
LSBL: MiniSystem&Ports (U1.64), Measure&Select (EncoderL.3 R30.2)
LSBR: MiniSystem&Ports (U1.73), Measure&Select (EncoderR.3 R32.2)
PCLK: MiniSystem&Ports (U1.78), Disp&Eye (Camera.9)
PTB8: MiniSystem&Ports (U1.89), Models (P2.1)
PTB9: MiniSystem&Ports (U1.90), Models (P2.3)
PTB16: MiniSystem&Ports (U1.95), Models (P2.2)
PTB17: MiniSystem&Ports (U1.96), Models (P2.4)
PTB18: MiniSystem&Ports (U1.97), Models (P2.6)
PTB19: MiniSystem&Ports (U1.98), Models (P2.8)
RD: MiniSystem&Ports (U1.115), Disp&Eye (Disp&Key.2)
Right: MiniSystem&Ports (U1.143), Disp&Eye (Disp&Key.6)
RS: MiniSystem&Ports (U1.117), Disp&Eye (Disp&Key.5)
RST: MiniSystem&Ports (U1.118), Disp&Eye (Disp&Key.8)
SCL: MiniSystem&Ports (U1.91), Disp&Eye (Camera.11)
SDA: MiniSystem&Ports (U1.92), Disp&Eye (Camera.12)
Servo: MiniSystem&Ports (U1.63), ServoPower (D3.1)
Up: MiniSystem&Ports (U1.142), Disp&Eye (Disp&Key.3)
VRH: MiniSystem&Ports (RH.2 U1.32), Models (P1.8 P1.10)
VRL: MiniSystem&Ports (RL.2 U1.33), Models (P1.12)
VSY: MiniSystem&Ports (U1.80), Disp&Eye (Camera.14)
WR: MiniSystem&Ports (U1.114), Disp&Eye (Disp&Key.7)
ZigBee_RX_T: MiniSystem&Ports (U1.45), Models (ZigBee.3)
ZigBee_TX_R: MiniSystem&Ports (U1.46), Models (ZigBee.2)